# Altium schematic sheet STM32F030F4P6.SchDoc
size A4
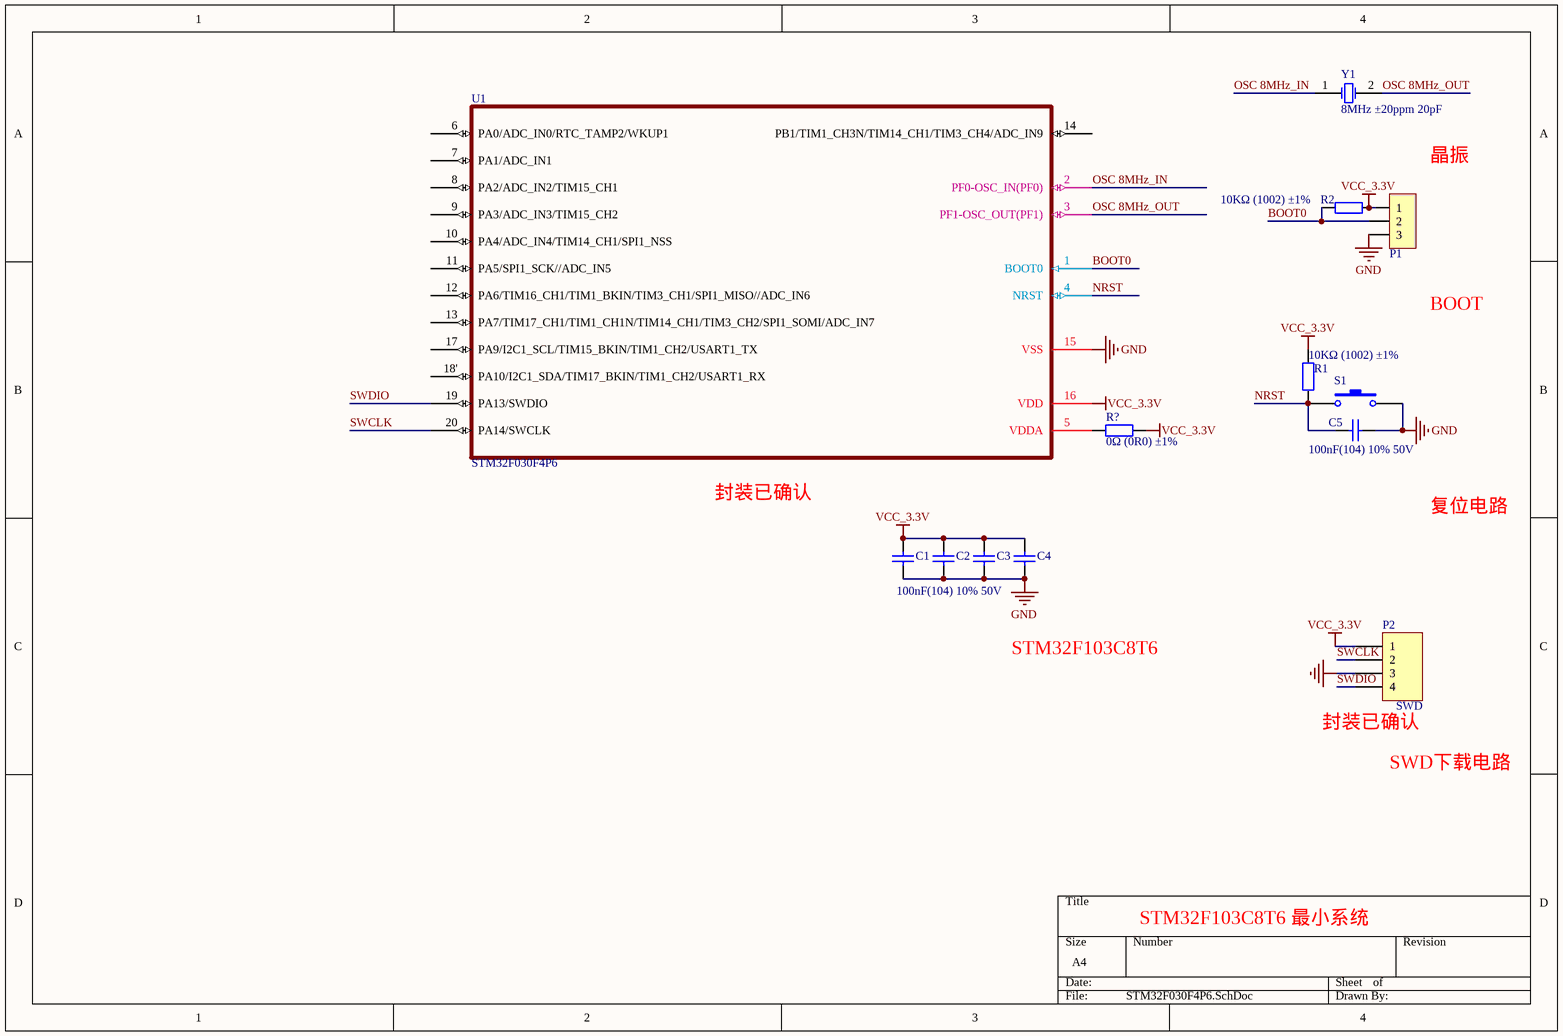
[diagram p0: STM32F030F4P6.SchDoc]

## Parts
C1  100nF(104) 10% 50V  [CAPC_0805]
C2  100nF(104) 10% 50V  [CAPC_0805]  (value not drawn)
C3  100nF(104) 10% 50V  [CAPC_0805]  (value not drawn)
C4  100nF(104) 10% 50V  [CAPC_0805]  (value not drawn)
C5  100nF(104) 10% 50V  [CAPC_0805]
P1  3P接插件  (value not drawn)
P2  SWD  [Header 2.54X4]
R1  10KΩ (1002) ±1%  [RESC_0805]
R2  10KΩ (1002) ±1%  [RESC_0805]
R?  0Ω (0R0) ±1%  [RESC_0603_2]
S1  SW-PB  [Header 2.54X2]  (value not drawn)
U1  STM32F030F4P6  [TSSOP_20]
Y1  8MHz ±20ppm 20pF  [SMD-5032_2P]

## Nets
GND: C1.1 C2.1 C3.1 C4.1 C5.2 P1.3 P2.3 S1.2 U1.15(VSS)
VCC_3.3V: C1.2 C2.2 C3.2 C4.2 P1.1 P2.1 R1.2 R2.2 R?.2 U1.16(VDD)
BOOT0: P1.2 R2.1 U1.1(BOOT0)
NRST: C5.1 R1.1 S1.1 U1.4(NRST)
OSC 8MHz_IN: U1.2(PF0-OSC_IN(PF0)) Y1.1(OSC1)
OSC 8MHz_OUT: U1.3(PF1-OSC_OUT(PF1)) Y1.2(OSC2)
SWCLK: P2.2 U1.20(PA14/SWCLK)
SWDIO: P2.4 U1.19(PA13/SWDIO)
NetR?_1: R?.1 U1.5(VDDA)

Not connected (* = marked no-connect by the designer): U1 6(PA0/ADC_IN0/RTC_TAMP2/WKUP1) 7(PA1/ADC_IN1) 8(PA2/ADC_IN2/TIM15_CH1) 9(PA3/ADC_IN3/TIM15_CH2) 10(PA4/ADC_IN4/TIM14_CH1/SPI1_NSS) 11(PA5/SPI1_SCK//ADC_IN5) 12(PA6/TIM16_CH1/TIM1_BKIN/TIM3_CH1/SPI1_MISO//ADC_IN6) 13(PA7/TIM17_CH1/TIM1_CH1N/TIM14_CH1/TIM3_CH2/SPI1_SOMI/ADC_IN7) 14(PB1/TIM1_CH3N/TIM14_CH1/TIM3_CH4/ADC_IN9) 17(PA9/I2C1_SCL/TIM15_BKIN/TIM1_CH2/USART1_TX) 18'(PA10/I2C1_SDA/TIM17_BKIN/TIM1_CH2/USART1_RX)

## Notes on the sheet
- 晶振
- BOOT
- (near U1) 封装已确认
- 复位电路
- STM32F103C8T6
- (near P2) 封装已确认
- SWD下载电路
- STM32F103C8T6 最小系统

## Library data of the parts
C1-C5 = 0805 100nF(104) 10% 50V: 贴片电容; ComponentLink1Description: 供应商链接; ComponentLink1URL: http://www.szlcsc.com/product/details_50686.html; Package: 0805; Supplier: LC; SuppliersPartNumber: C49678
P2 = Header 4: Header, 4-Pin; LatestRevisionDate: 17-Jul-2002; LatestRevisionNote: Re-released for DXP Platform.; Publisher: Altium Limited
R1 R2 = 0805 10KΩ (1002) 1%: 贴片电阻; ComponentLink1Description: 供应商链接; ComponentLink1URL: http://www.szlcsc.com/product/details_18102.html; Package: 0805; Supplier: LC; SuppliersPartNumber: C17414
R? = 0603 0Ω (0R0) ±1%: 贴片电阻; ComponentLink1Description: 供应商链接; ComponentLink1URL: http://www.szlcsc.com/product/details_21903.html; Package: 0603; Supplier: LC; SuppliersPartNumber: C21189
S1 = SW-PB_1: 微动开关; Published: 24-Mar-1999; LatestRevisionDate: 17-Jul-2002; LatestRevisionNote: Re-released for DXP Platform.; PackageReference: SPST-2; Publisher: Altium Limited
U1 = STM32F030F4P6: ARM; ComponentLink1Description: 供应商链接; ComponentLink1URL: http://www.szlcsc.com/product/details_33873.html; Package: TSSOP-20; Supplier: LC; SuppliersPartNumber: C32908
Y1 = SMD-5032_2P 8MHz 20ppm 20pF: 贴片晶振; ComponentLink1Description: 供应商链接; ComponentLink1URL: http://www.szlcsc.com/product/details_117214.html; Package: SMD-5032_2P; Supplier: LC; SuppliersPartNumber: C115962